# Altium project VariableBenchPowerSupply.PrjPcb
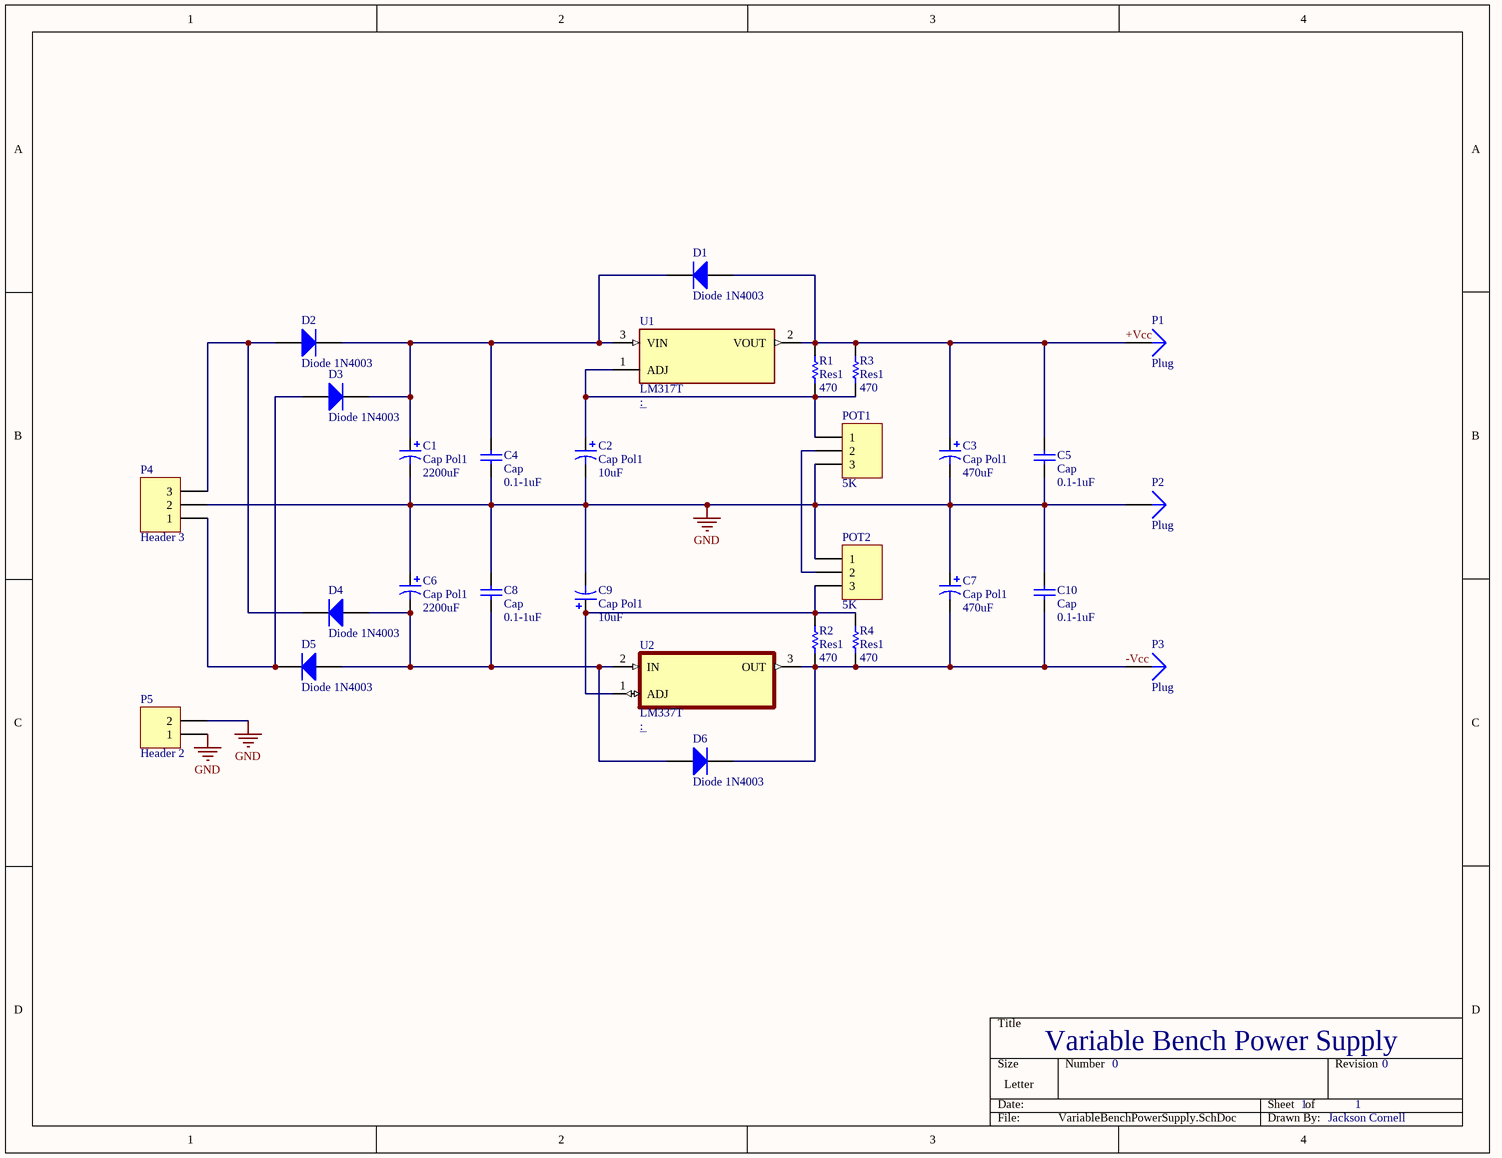
[diagram p0: VariableBenchPowerSupply.SchDoc]
1 sheet, 29 parts. Net scope: global (net labels, ports and power ports of the same name join across sheets).
Board file: VariableBenchPowerSupply.PcbDoc

## Sheet VariableBenchPowerSupply.SchDoc
size Letter

### Parts
C1  Cap Pol1  value 2200uF  [CAPR5-4X5]
C2  Cap Pol1  value 10uF  [CAPR5-4X5]
C3  Cap Pol1  value 470uF  [CAPR5-4X5]
C4  Cap  value 0.1-1uF  [RAD-0.3]
C5  Cap  value 0.1-1uF  [RAD-0.3]
C6  Cap Pol1  value 2200uF  [CAPR5-4X5]
C7  Cap Pol1  value 470uF  [CAPR5-4X5]
C8  Cap  value 0.1-1uF  [RAD-0.3]
C9  Cap Pol1  value 10uF  [CAPR5-4X5]
C10  Cap  value 0.1-1uF  [RAD-0.3]
D1  Diode 1N4003  [DO-41]
D2  Diode 1N4003  [DO-41]
D3  Diode 1N4003  [DO-41]
D4  Diode 1N4003  [DO-41]
D5  Diode 1N4003  [DO-41]
D6  Diode 1N4003  [DO-41]
P1  Plug  [PIN1]
P2  Plug  [PIN1]
P3  Plug  [PIN1]
P4  Header 3  [HDR1X3]
P5  Header 2  [HDR1X2]
POT1  5K  [HDR1X3]
POT2  5K  [HDR1X3]
R1  Res1  value 470  [AXIAL-0.3]
R2  Res1  value 470  [AXIAL-0.3]
R3  Res1  value 470  [AXIAL-0.3]
R4  Res1  value 470  [AXIAL-0.3]
U1  LM317T  [TO254P1054X470X1955-3]
U2  LM337T  [TO254P1054X470X1955-3]

### Nets
GND: C1.2 C2.2 C3.2 C4.1 C5.2 C6.1 C7.1 C8.2 C9.2 C10.1 P2.1 P4.2 P5.1 P5.2 POT1.3 POT2.1
+Vcc: C3.1 C5.1 D1.1(A) P1.1 R1.2 R3.2 U1.2(VOUT)
-Vcc: C7.2 C10.2 D6.2(K) P3.1 R2.1 R4.1 U2.3(OUT)
NetC1_1: C1.1 C4.2 D1.2(K) D2.2(K) D3.2(K) U1.3(VIN)
NetC2_1: C2.1 POT1.1 R1.1 R3.1 U1.1(ADJ)
NetC6_2: C6.2 C8.1 D4.1(A) D5.1(A) D6.1(A) U2.2(IN)
NetC9_1: C9.1 POT2.3 R2.2 R4.2 U2.1(ADJ)
NetD2_1: D2.1(A) D4.2(K) P4.3
NetD3_1: D3.1(A) D5.2(K) P4.1
NetPOT1_2: POT1.2 POT2.2

### Notes on the sheet
- Variable Bench Power Supply
- 0
- 1
- Jackson Cornell

### Library data of the parts
C1-C3 C6 C7 C9 = Cap Pol1: Polarized Capacitor (Radial); Published: 8-Jun-2000; LatestRevisionDate: 17-Jul-2002; LatestRevisionNote: Re-released for DXP Platform.; PackageReference: RB7.6-15; Publisher: Altium Limited; PackageDescription: Polarized Capacitor (Radial); 2 Leads
C4 C5 C8 C10 = Cap: Capacitor; Published: 8-Jun-2000; LatestRevisionDate: 17-Jul-2002; LatestRevisionNote: Re-released for DXP Platform.; PackageReference: RAD-0.3; Publisher: Altium Limited; PackageDescription: Radial Cap, Thru-Hole; 2 Leads; 0.3 in Pin Spacing
D1-D6 = Diode 1N4003: 1 Amp General Purpose Rectifier; Published: 8-Jun-2000; LatestRevisionDate: 17-Jul-2002; LatestRevisionNote: Re-released for DXP Platform.; DatasheetVersion: 1998; PackageVersion: Aug-1999; PackageReference: DO-41; Publisher: Altium Limited; PackageDescription: Diode, Axial; Body 5.2 x 2.7 mm (LxDia. max), Lead Dia. 0.86 mm (max); Code_JEDEC: DO-204-AL; ComponentLink1Description: Manufacturer Link; ComponentLink1URL: http://www.fairchildsemi.com/; ComponentLink2Description: Datasheet; ComponentLink2URL: http://www.fairchildsemi.com/ds/1N%2F1N4001.pdf
P4 POT1 POT2 = Header 3: Header, 3-Pin; LatestRevisionDate: 17-Jul-2002; LatestRevisionNote: Re-released for DXP Platform.; Publisher: Altium Limited
P5 = Header 2: Header, 2-Pin; LatestRevisionDate: 17-Jul-2002; LatestRevisionNote: Re-released for DXP Platform.; Publisher: Altium Limited
R1-R4 = Res1: Resistor; Published: 8-Jun-2000; LatestRevisionDate: 17-Jul-2002; LatestRevisionNote: Re-released for DXP Platform.; PackageReference: AXIAL-0.3; Publisher: Altium Limited; PackageDescription: Axial Device, Thru-Hole; 2 Leads; 0.3 in Pin Spacing
U1 = LM317T/NOPB: 1.5-A, 40-V, adjustable linear voltage regulator 3-TO-220 0 to 125; MF: Texas Instruments; DigiKey-Purchase-URL: https://snapeda.com/shop?store=DigiKey&id=358009; Mouser-Purchase-URL: https://snapeda.com/shop?store=Mouser&id=358009; SnapEDA_Link: https://www.snapeda.com/parts/LM317T/NOPB/Texas%20Instruments/view-part/358009/?ref=snap; Price: None; MP: LM317T/NOPB; Value: *; Availability: Good; Texas_Instruments-Purchase-URL: https://snapeda.com/shop?store=Texas+Instruments&id=358009; Package: TO-220-3 Texas Instruments
U2 = LM337T: Linear Voltage Regulator IC 1 Output 1.5A TO-220AB; MF: ON Semiconductor; MP: LM337T; Price: None; Availability: Good; SnapEDA_Link: https://www.snapeda.com/parts/LM337T/ON%20Semiconductor/view-part/2472851/?ref=snap; Arrow_Electronics-Purchase-URL: https://snapeda.com/shop?store=Arrow+Electronics&id=2472851; Value: *; Package: TO-220 Linear Technology; DigiKey-Purchase-URL: https://snapeda.com/shop?store=DigiKey&id=2472851
P1-P3 = Plug: LatestRevisionDate: 17-Jul-2002; LatestRevisionNote: Re-released for DXP Platform.; Publisher: Altium Limited